# EAGLE design ATTinyServoSMT_v10 (EAGLE 6.4)
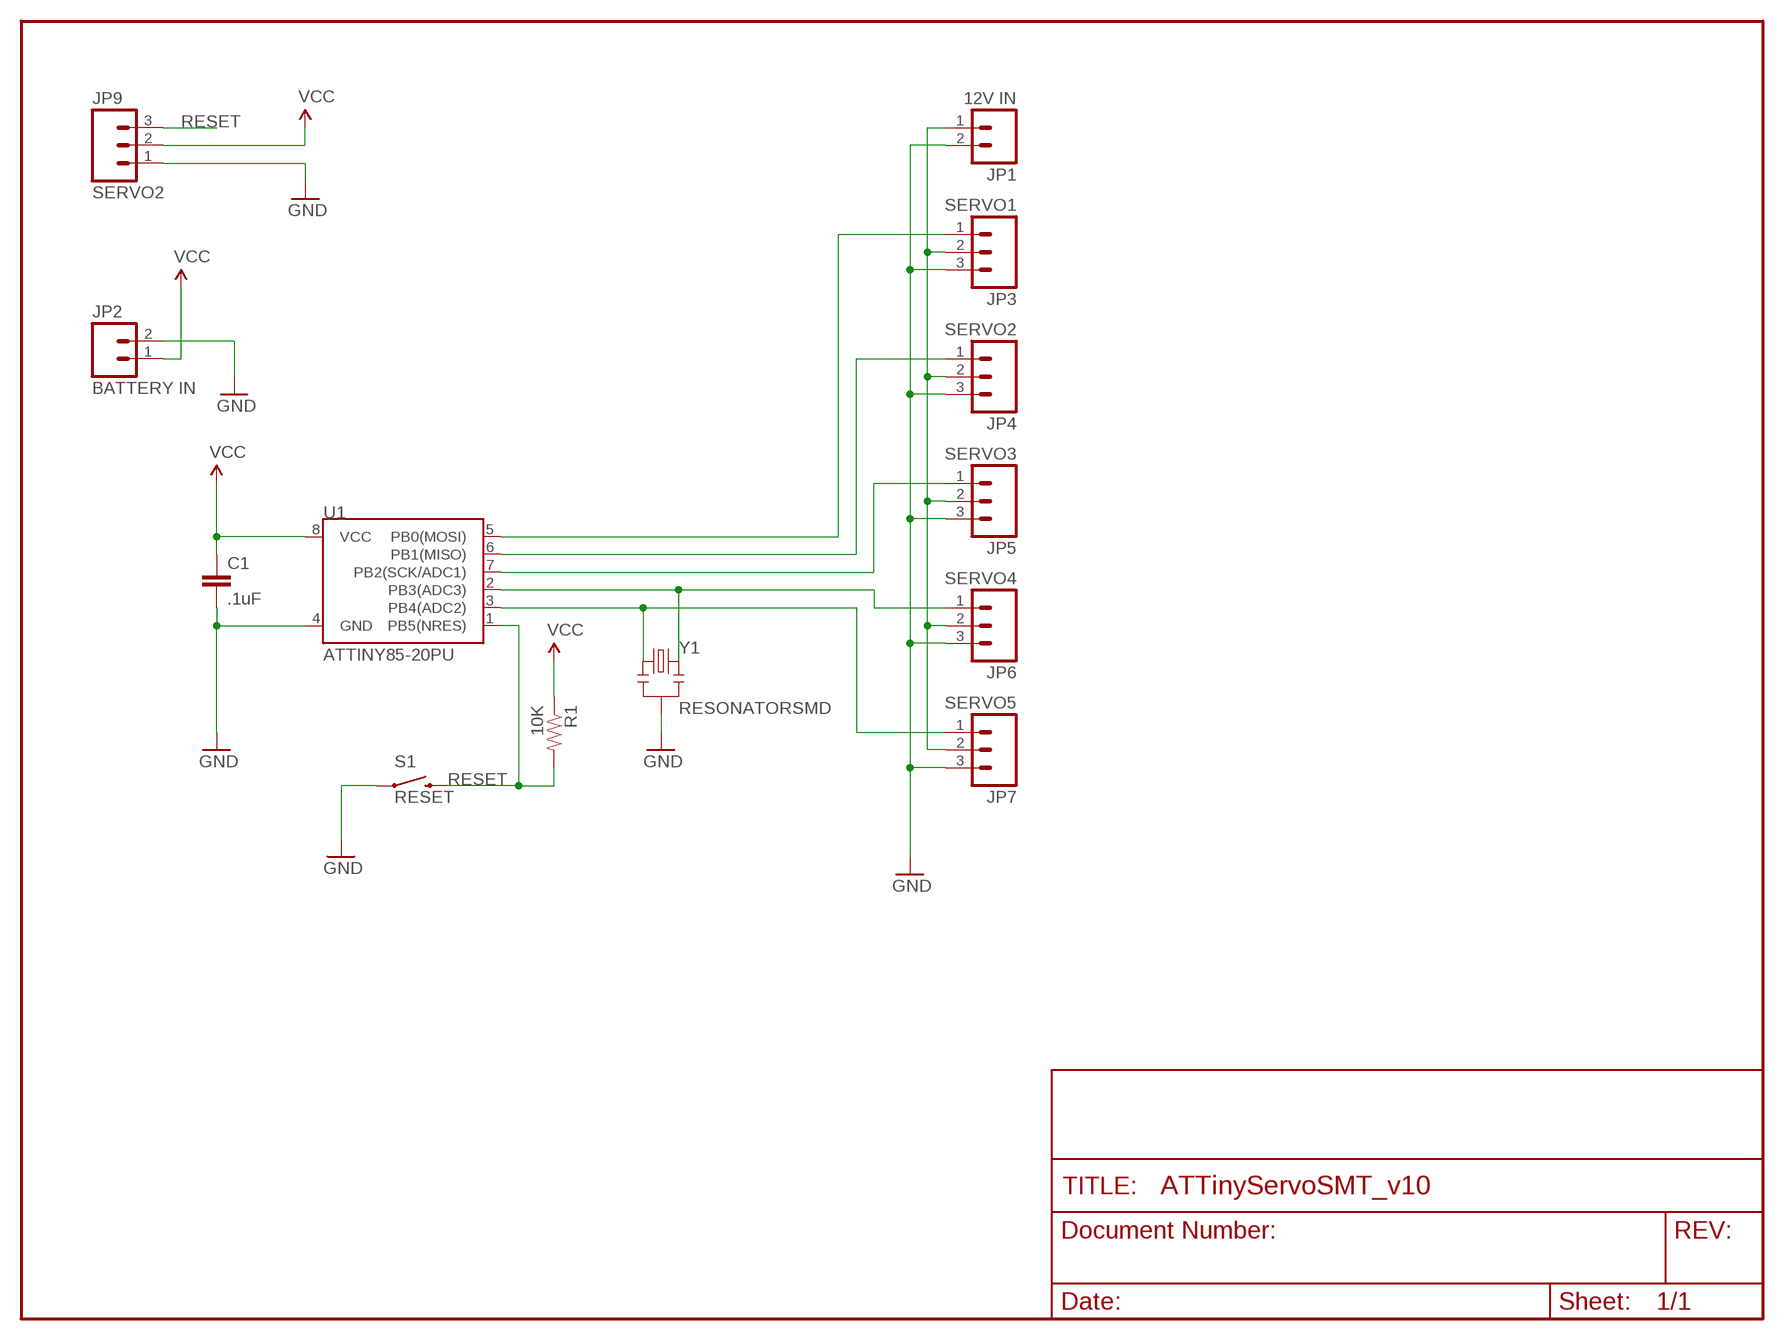
[diagram p0: schematic, sheet 1]

## Parts
C1  .1uF  CAP0603-CAP  [0603-CAP]
JP1  12V IN  M023.5MM  [SCREWTERMINAL-3.5MM-2]
JP2  BATTERY IN  M023.5MM  [SCREWTERMINAL-3.5MM-2]
JP3  SERVO1  M03PTH  [1X03]
JP4  SERVO2  M03PTH  [1X03]
JP5  SERVO3  M03PTH  [1X03]
JP6  SERVO4  M03PTH  [1X03]
JP7  SERVO5  M03PTH  [1X03]
JP9  SERVO2  M03PTH  [1X03]
R1  10K  RESISTOR0603-RES  [0603-RES]
S1  RESET  SWITCH-MOMENTARY-2SMD  [TACTILE_SWITCH_SMD]
U1  ATTINY85-20PU  ATTINY45  [SO08-EIAJ]
Y1  RESONATORSMD  [RESONATOR-SMD]

## Nets
GND: C1.2 JP1.2 JP2.2 JP3.3 JP4.3 JP5.3 JP6.3 JP7.3 JP9.1 S1.1 U1.4(GND) Y1.2
N$1: JP1.1 JP3.2 JP4.2 JP5.2 JP6.2 JP7.2
N$2: JP6.1 U1.2(PB3(ADC3)) Y1.3
N$3: JP7.1 U1.3(PB4(ADC2)) Y1.1
N$7: JP5.1 U1.7(PB2(SCK/ADC1))
N$8: JP4.1 U1.6(PB1(MISO))
N$9: JP3.1 U1.5(PB0(MOSI))
RESET: JP9.3 R1.2 S1.3 U1.1(PB5(NRES))
VCC: C1.1 JP2.1 JP9.2 R1.1 U1.8(VCC)

## Library data of the parts
C1 = SparkFun-Capacitors:CAP: Capacitor Standard 0603 ceramic capacitor, and 0.1" leaded capacitor.
JP1 JP2 = SparkFun:M02: Header 2 Standard 2-pin 0.1" header. Use with straight break away headers (SKU : PRT-00116), right angle break away headers (PRT-00553), swiss pins (PRT-00743), machine pins (PRT-00117), and female headers (PRT-00115). Molex polarized connector foot print use with SKU : PRT-08233 with associated crimp pins and housings.
JP3-JP7 JP9 = SparkFun:M03: Header 3 Standard 3-pin 0.1" header. Use with straight break away headers (SKU : PRT-00116), right angle break away headers (PRT-00553), swiss pins (PRT-00743), machine pins (PRT-00117), and female headers (PRT-00115). Molex polarized connector foot print use with SKU : PRT-08232 with associated crimp pins and housings.
R1 = SparkFun:RESISTOR: Resistor Basic schematic elements and footprints for 0603, 1206, and PTH resistors.
S1 = SparkFun:SWITCH-MOMENTARY-2
U1 = SparkFun:ATTINY45: Atmel ATTiny45
Y1 = SparkFun:RESONATOR: Resonator Small SMD resonator. This is the itty bitty 10/20MHz resonators with built in caps. CSTCE10M0G55 and CSTCE20M0V53. Footprint has been reviewed closely but hasn't been tested yet.

## Board
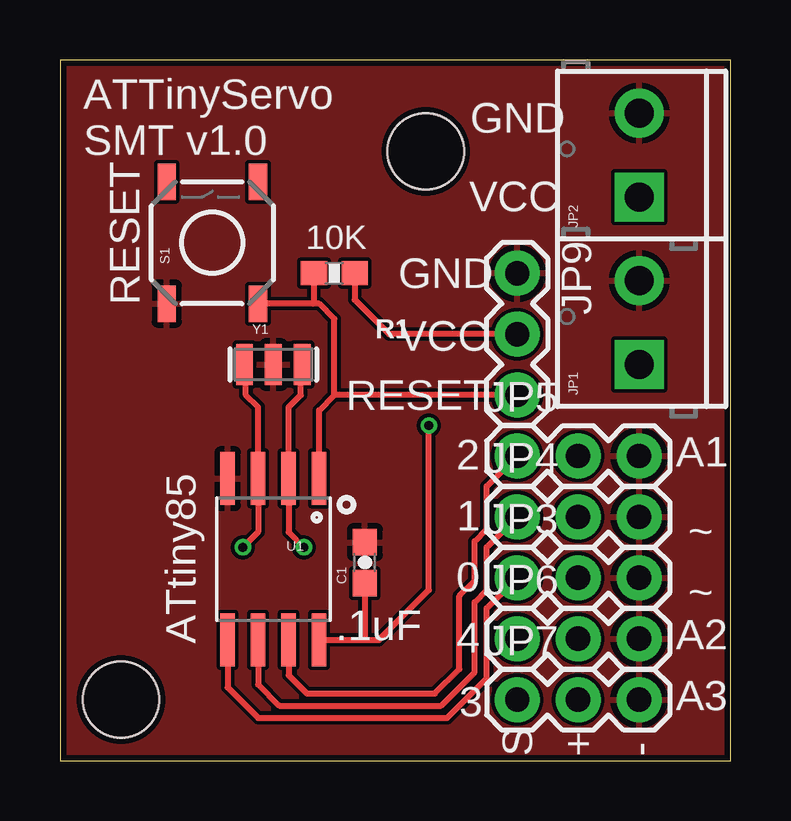
[diagram p1: board, top side]
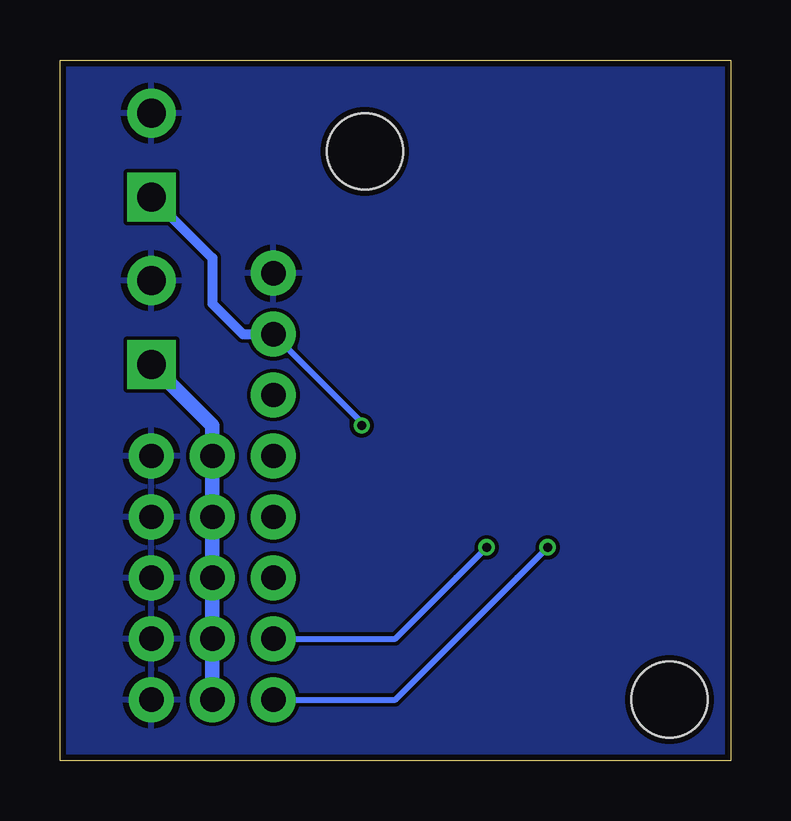
[diagram p2: board, bottom side, seen from below]

Size 27.94 x 29.21 mm. Coordinates in mm from the lower left corner, seen from the top.
Outline: 0,0 27.94,0 27.94,29.21 0,29.21 0,0
Copper layers (1*16): Top 0.035mm / dielectric 1.5mm / Bottom 0.035mm
Design rules "Fusion_eagle_rule_v1.1": minimum track width 6mil, minimum drill 12mil, track to track 6mil, track to pad 6mil, pad to pad 6mil, via to via 6mil, smd to smd 0mil, copper to edge 10mil, drill to drill 10mil, minimum pad ring 10mil, minimum via ring 6mil, stop-mask expansion 2mil, vias tented up to drill 100mil, thermal gap 10mil
Holes 3.17 mm at 2.54,2.54 15.24,25.4

### Footprints (pad centres in the part's own frame; a part is rotated, then mirrored left to right if it is on the bottom)
0603-CAP = smd 1.1 x 1: 1 -0.85,0; 2 0.85,0
SCREWTERMINAL-3.5MM-2 = drill 1.2 pad 2.032 square: 1 0,0 | drill 1.2 pad 2.032: 2 3.5,0
1X03 = drill 1.016 pad 1.88: 1 0,0; 2 2.54,0; 3 5.08,0
0603-RES = smd 1.1 x 1: 1 -0.85,0; 2 0.85,0
TACTILE_SWITCH_SMD = smd 1.524 x 0.762: 1 -2.54,1.905; 2 2.54,1.905; 3 -2.54,-1.905; 4 2.54,-1.905
SO08-EIAJ = smd 0.61 x 2.21: 1 -1.905,-3.378; 2 -0.635,-3.378; 3 0.635,-3.378; 4 1.905,-3.378; 5 1.905,3.353; 6 0.635,3.353; 7 -0.635,3.353; 8 -1.905,3.353
RESONATOR-SMD = smd 0.7 x 1.7: 1 -1.2,0; 2 0,0; 3 1.2,0

### Placement (x,y rotation side)
C1  12.7,8.26 90 top
JP1  24.13,16.51 90 top
JP2  24.13,23.5 90 top
JP3  19.05,7.62 0 top
JP4  19.05,10.16 0 top
JP5  19.05,12.7 0 top
JP6  19.05,5.08 0 top
JP7  19.05,2.54 0 top
JP9  19.05,20.32 270 top
R1  11.43,20.32 180 top
S1  6.35,21.59 90 top
U1  8.89,8.38 180 top
Y1  8.89,16.51 0 top

### Tracks (layer width: path | path; a pad name or v marks a point on that pad's centre or on a via)
GND
  pour Top: 0,0 27.94,0 27.94,29.21 0,29.21
  pour Bottom: 0,0 27.94,0 27.94,29.21 0,29.21
N$1
  Bottom 0.61: JP1.1 21.59,13.97 JP5.2 JP4.2 JP3.2 JP6.2 JP7.2
N$2  (via drill 0.38)
  Top 0.254: Y1.3 10.03,16.45 10.03,15.24 9.53,14.73 U1.2 9.53,9.53 v10.16,8.89
  Bottom 0.254: JP6.1 13.97,5.08 11.43,7.62 v10.16,8.89
N$3  (via drill 0.38)
  Top 0.254: Y1.1 7.75,16.45 7.75,15.24 8.26,14.73 U1.3 8.26,9.53 v7.62,8.89
  Bottom 0.254: JP7.1 13.97,2.54 8.89,7.62 v7.62,8.89
N$7
  Top 0.254: U1.7 9.53,3.56 10.29,2.79 15.62,2.79 16.64,3.81 16.64,6.86 17.27,7.49 17.27,9.14 17.78,9.65 17.78,11.43 JP5.1
N$8
  Top 0.254: U1.6 8.26,3.17 9.14,2.29 15.88,2.29 17.27,3.68 17.27,6.6 17.78,7.11 17.78,8.89 JP4.1
N$9
  Top 0.254: U1.5 6.99,3.05 8.26,1.78 16.13,1.78 17.78,3.43 17.78,6.35 JP3.1
RESET
  Top 0.254: JP9.3 11.43,15.24 | U1.1 10.79,14.61 11.43,15.24 | 11.43,15.24 11.43,18.41 10.79,19.05 10.54,19.05 | 10.54,19.05 S1.3 | R1.2 10.58,19.09 10.54,19.05
VCC  (via drill 0.38)
  Top 0.254: JP9.2 13.72,17.78 12.28,19.22 R1.1 | U1.8 12.7,5.03 | 12.7,5.03 13.28,5.03 15.37,7.11 v15.37,13.97 | C1.1 12.7,5.03
  Bottom 0.254: v15.37,13.97 15.37,14.1 JP9.2
  Bottom 0.406: JP2.1 21.59,20.95 21.59,19.05 20.32,17.78 JP9.2

### Text on the board
tPlace: GND | ATTinyServo / SMT v1.0 | VCC | GND | RESET | VCC | RESET | 2 | A1 | 1 | ~ | 0 | ~ | ATtiny85 | .1uF | A2 | 4 | 3 | A3 | S | + | -